# Altium schematic sheet Mechanical.SchDoc: USB2RMP
size A4; Date: *******; ApprovedBy: *******; CheckedBy: Thomas Schaub; Author: *******; CompanyName: *******; DrawnBy: Kevin Schaerer; Engineer: *******; Organization: *******; Address1: *******; Address2: *******; Address3: *******; Address4: *******; DocumentNumber: Doc Num; Revision: 1.1; SheetNumber: 3; SheetTotal: 3; CurrentTime: *******; CurrentDate: *******; Time: *******; DocumentFullPathAndName: *******; DocumentName: *******; ModifiedDate: *******; ImagePath: *******; ProjectName: *******; Application_BuildNumber: *******
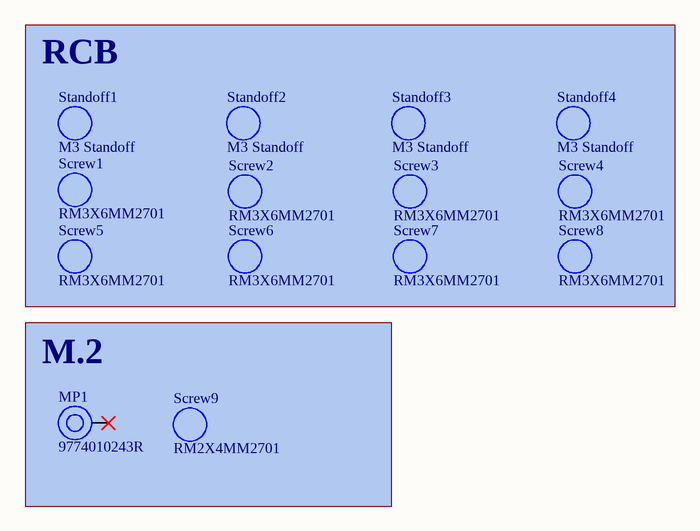
[diagram p0: Mechanical.SchDoc]

## Parts
MP1  9774010243R  [9774010243]
Screw1  RM3X6MM2701  (no BOM)
Screw2  RM3X6MM2701  (no BOM)
Screw3  RM3X6MM2701  (no BOM)
Screw4  RM3X6MM2701  (no BOM)
Screw5  RM3X6MM2701  (no BOM)
Screw6  RM3X6MM2701  (no BOM)
Screw7  RM3X6MM2701  (no BOM)
Screw8  RM3X6MM2701  (no BOM)
Screw9  RM2X4MM2701  (no BOM)
Standoff1  M3 Standoff  (no BOM)
Standoff2  M3 Standoff  (no BOM)
Standoff3  M3 Standoff  (no BOM)
Standoff4  M3 Standoff  (no BOM)

## Blocks framed on the sheet
RCB: Screw1-Screw8 Standoff1-Standoff4
M.2: MP1 Screw9

## Nets

Not connected (* = marked no-connect by the designer): MP1 1*

## Notes on the sheet
- Title:
- Drawn By:
- Checked By:
- NetTimeLogic GmbH
- Badenerstrasse 595
- Size:
- Date:
- File:
- License:
- Email:
- A4
- conctact@nettimelogic.com <mailto:contact@nettimelogic.com>
- Revision:
- Sheet
- of
- Website:
- www.nettimelogic.com <http://www.nettimelogic.com>
- 8048 Zürich
- Switzerland

## Library data of the parts
MP1 = CMP-082-000049-2: WA-SMSI SMT Steel Spacer with internal Thread, OD 4.35mm, M2 x 1mm; Manufacturer: Wurth Elektronik; Inside Diameter: 2.8mm; Surface: Tin; Design Item ID: 9774010243R; Match Code: WA-SMSI; Source: WA-SMSI.SchLib; Operating Temperature Min: -55°C; Outside Diameter: 4.35mm; Material: Steel; ComponentLink1Description: Website Link; Pin Count: 1; Component Type: Standard; Packaging: Tape and Reel; ComponentLink2URL: https://www.we-online.com/redexpert/spec/9774010243R?ad; Manufacturer Part Number: 9774010243R; ComponentLink2Description: Datasheet Link; Category: SMT Spacers; ComponentLink1URL: https://www.we-online.com/redexpert/article/9774010243R?ad; Operating Temperature Max: 150°C; Height: 1mm; Mount: Surface Mount; Thread Size: M2
Screw1-Screw8 = CMP-00028-00002-1: Hardware;  Metric phillips pan head seelskrew M3 thd 6mm long with silicone oring; Series: SEELSKREW®; Mounting Technology: Screw; Length: 0.24inch; Material: Stainless Steel; Thread Size: M3
Screw9 = CMP-00028-00003-1: Hardware; Metric phillips pan head seelskrew M2 thd 4mm long with silicone oring; Series: SEELSKREW®; Material: Stainless Steel; Thread Size: M2; Mounting Technology: Hardware; Length: 0.157inch
Standoff1-Standoff4 = CMP-00028-00001-2: Standoff, 5mm Hex, Female, Threaded M3, Length 10mm, Brass/Nickel; Body Plating: Nickel; Gender: Female, Female; Reach SVHC Compliant: No; Shape: Hex; Threaded/Unthreaded: Threaded; Thread Size: M3; Mounting Technology: External; Size: 0.197inch; Width: 5mm; Lead Free: Lead Free; Body Length: 10mm; Length: 10mm; Plating: Nickel; Material: Brass; Package Quantity: 10; Series: -; Color: Natural; Outside Diameter: 5mm